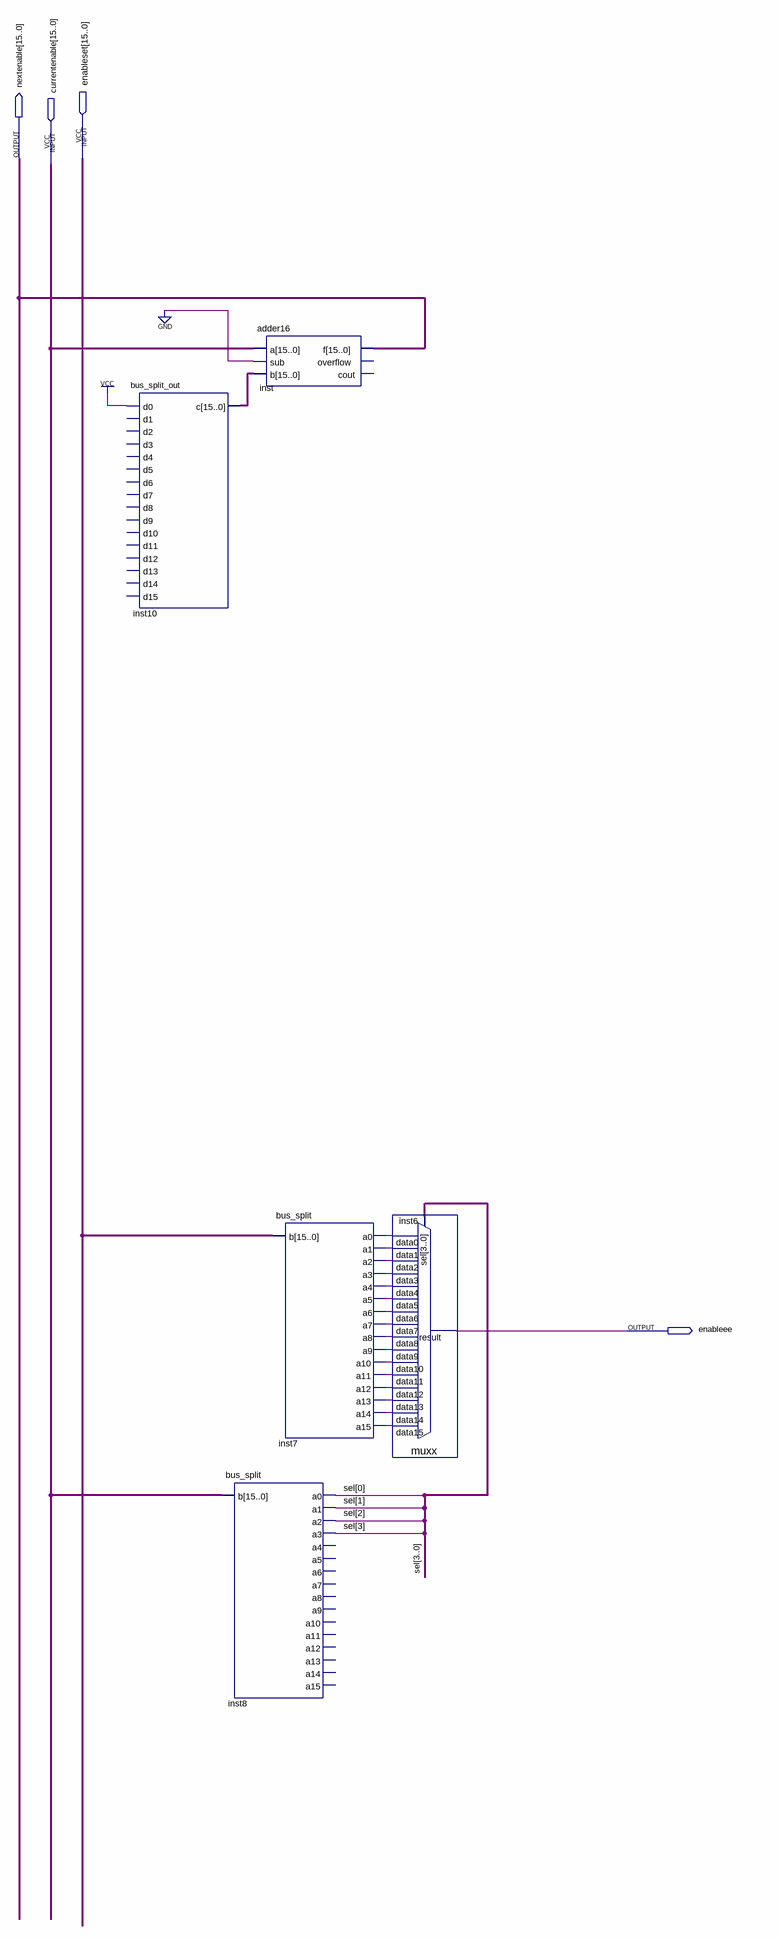
[diagram p0: schematic sheet]
// Quartus schematic decoder_sequential_receiver.bdf as structural Verilog: 5 symbols, 4 pins
module decoder_sequential_receiver (
  input  [15:0] enableset,
  input  [15:0] currentenable,
  output [15:0] nextenable,
  output enableee
);

  wire inst7_a0, inst7_a1, inst7_a2, inst7_a3, inst7_a4, inst7_a5, inst7_a6, inst7_a7, inst7_a8, inst7_a9,
       inst7_a10, inst7_a11, inst7_a12, inst7_a13, inst7_a14, inst7_a15;
  wire [3:0] sel;
  wire [15:0] inst10_c;

  bus_split_out inst10 (
    .d0(1'b1), .c(inst10_c));  // open: d1, d2, d3, d4, d5, d6, d7, d8, d9, d10, d11, d12, d13, d14, d15
  adder16 inst (.a(currentenable), .sub(1'b0), .b(inst10_c), .f(nextenable));  // open: overflow, cout
  bus_split inst8 (
    .b(currentenable), .a0(sel[0]), .a1(sel[1]), .a2(sel[2]), .a3(sel[3]));  // open: a4, a5, a6, a7, a8, a9, a10, a11, a12, a13, a14, a15
  bus_split inst7 (
    .b(enableset), .a0(inst7_a0), .a1(inst7_a1), .a2(inst7_a2), .a3(inst7_a3), .a4(inst7_a4), .a5(inst7_a5),
    .a6(inst7_a6), .a7(inst7_a7), .a8(inst7_a8), .a9(inst7_a9), .a10(inst7_a10), .a11(inst7_a11),
    .a12(inst7_a12), .a13(inst7_a13), .a14(inst7_a14), .a15(inst7_a15));
  muxx inst6 (
    .data15(inst7_a15), .data14(inst7_a14), .data13(inst7_a13), .data12(inst7_a12), .data11(inst7_a11),
    .data10(inst7_a10), .data9(inst7_a9), .data8(inst7_a8), .data7(inst7_a7), .data6(inst7_a6),
    .data5(inst7_a5), .data4(inst7_a4), .data3(inst7_a3), .data2(inst7_a2), .data1(inst7_a1),
    .data0(inst7_a0), .sel(sel), .result(enableee));
endmodule
